# EAGLE schematic 74273_on_all_8_addresses (EAGLE 7.2.0)
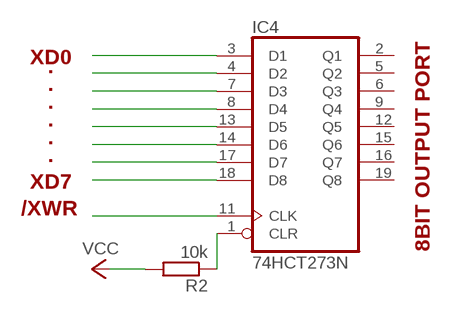
[diagram p0: schematic, sheet 1]

## Parts
IC4  74HCT273N  [DIL20]
R2  10k  R-EU_0204/5  [0204/5]

## Nets
N$13: IC4.3(D1)
N$14: IC4.4(D2)
N$15: IC4.7(D3)
N$16: IC4.8(D4)
N$17: IC4.13(D5)
N$18: IC4.14(D6)
N$19: IC4.17(D7)
N$20: IC4.18(D8)
N$21: IC4.1(CLR) R2.1
N$22: IC4.11(CLK)
VCC: R2.2
Unconnected: IC4.2(Q1) IC4.5(Q2) IC4.6(Q3) IC4.9(Q4) IC4.12(Q5) IC4.15(Q6) IC4.16(Q7) IC4.19(Q8)

## Notes on the sheet
- XD0
- .
- .
- .
- .
- .
- .
- XD7
- /XWR
- 8BIT OUTPUT PORT

## Power pins joined to a net without a drawn wire
GND: IC4.10(GND)
VCC: IC4.20(VCC)

## Library data of the parts
IC4 = 74xx-eu:74*273: Octal D type FLIP FLOP, clear
R2 = rcl:R-EU_: RESISTOR, European symbol